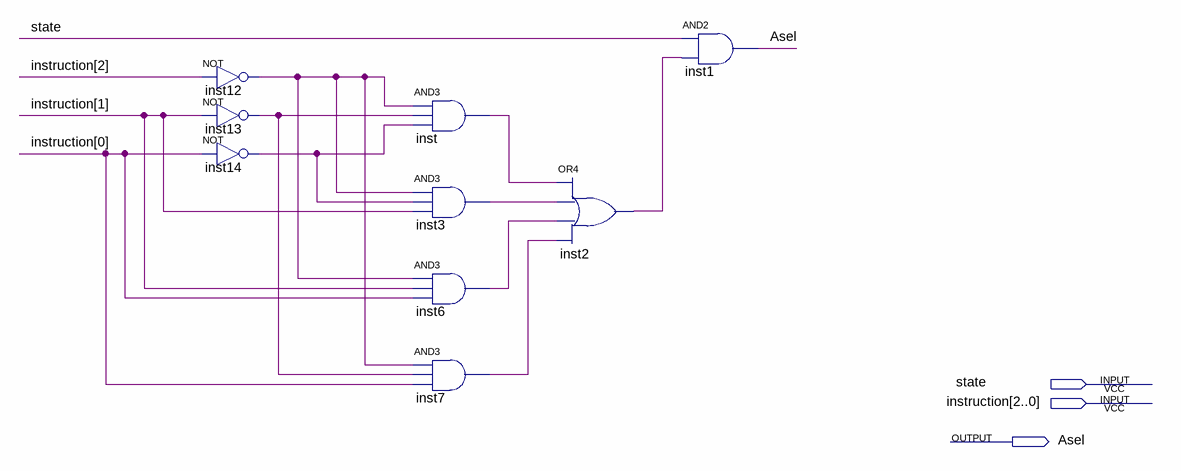
[diagram p0: schematic sheet]
// Quartus schematic controler_a_select.bdf as structural Verilog: 9 symbols, 3 pins
module controler_a_select (
  input  state,
  input  [2:0] instruction,
  output Asel
);

  wire inst2_out, inst3_out, inst6_out, inst7_out, inst12_out, inst13_out, inst14_out, inst_out;

  not inst12 (inst12_out, instruction[2]);
  not inst13 (inst13_out, instruction[1]);
  not inst14 (inst14_out, instruction[0]);
  and inst (inst_out, inst12_out, inst13_out, inst14_out);
  and inst3 (inst3_out, inst12_out, inst14_out, instruction[1]);
  and inst6 (inst6_out, inst12_out, instruction[1], instruction[0]);
  and inst7 (inst7_out, inst12_out, inst13_out, instruction[0]);
  or inst2 (inst2_out, inst_out, inst3_out, inst6_out, inst7_out);
  and inst1 (Asel, state, inst2_out);
endmodule
